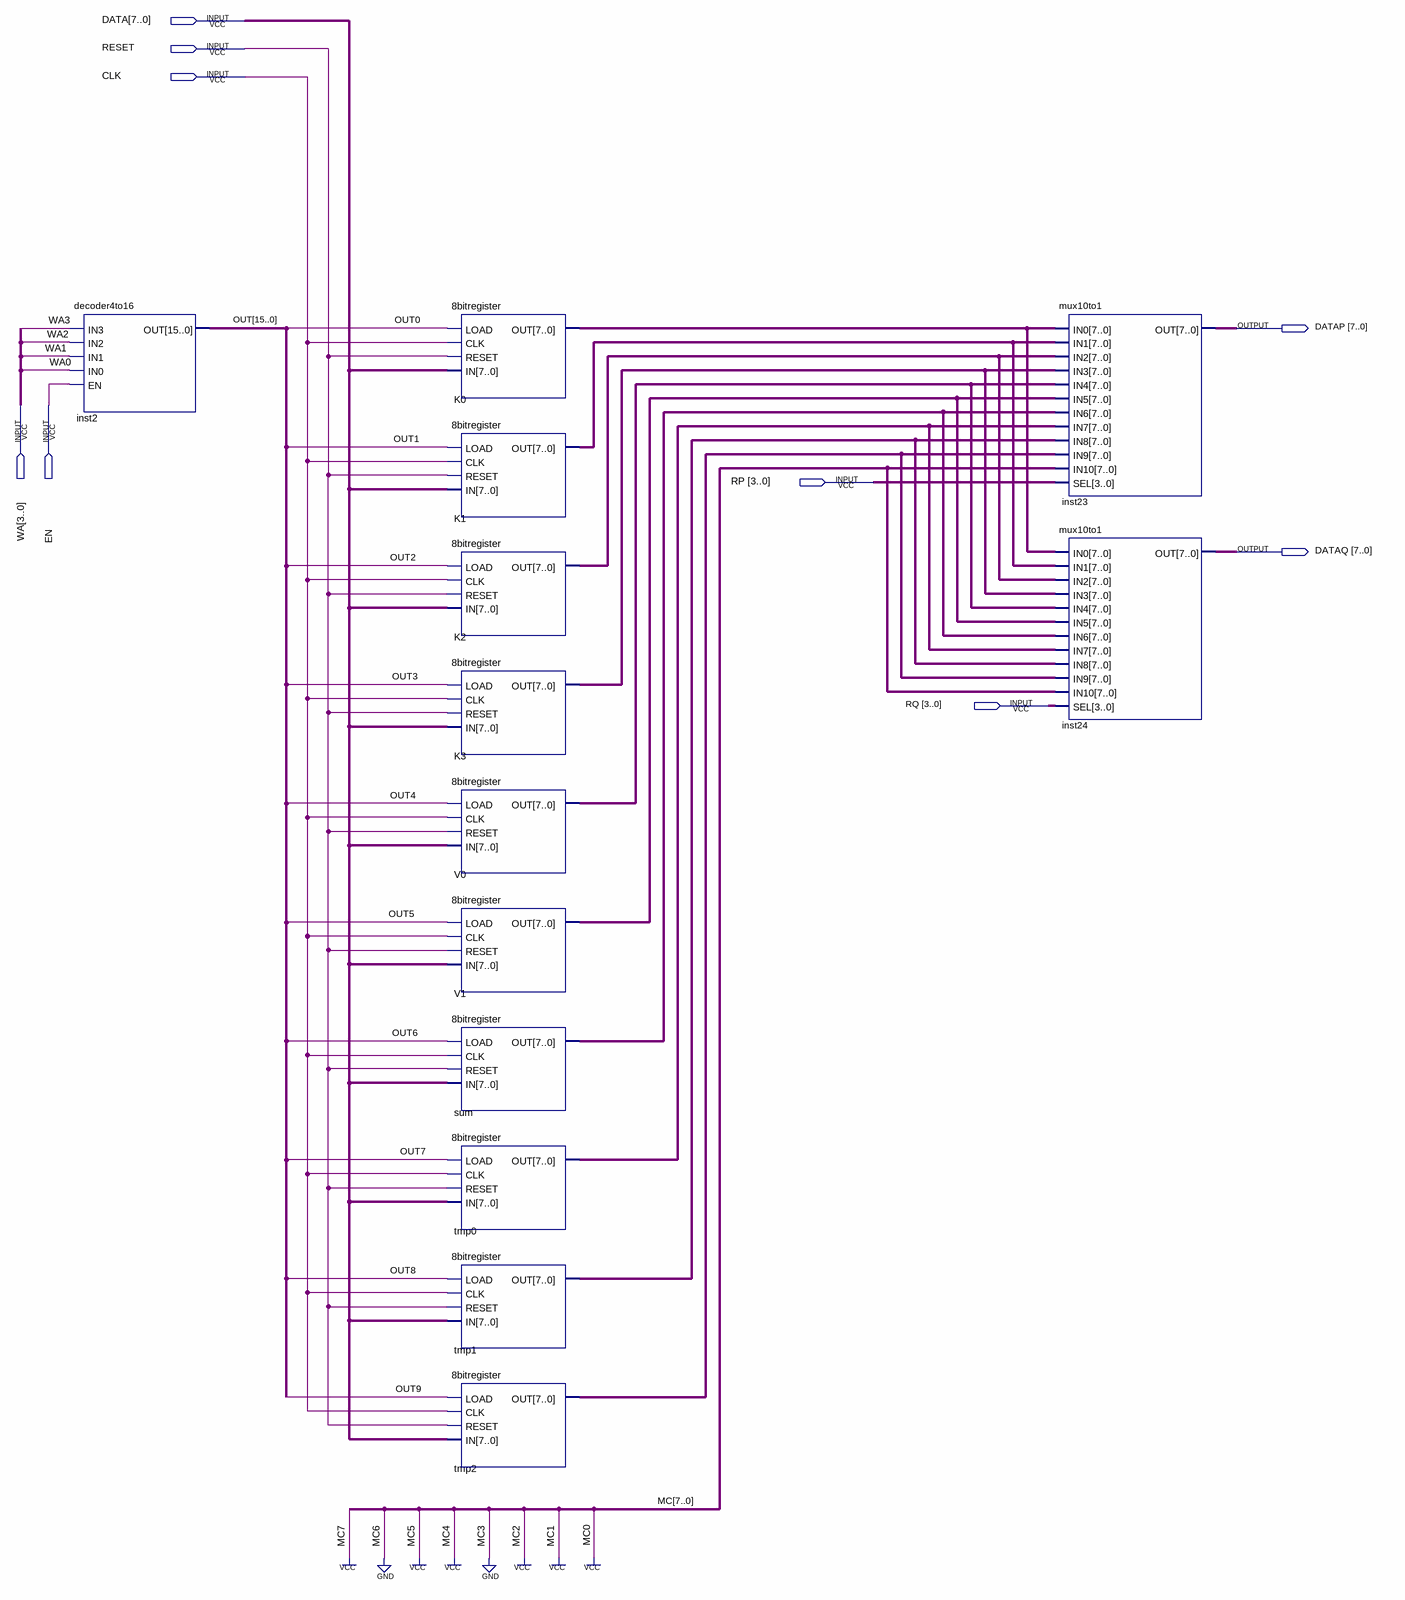
[diagram p0: schematic sheet]
// Quartus schematic reg10file8bit.bdf as structural Verilog: 13 symbols, 9 pins
module reg10file8bit (
  input  [7:0] DATA,
  input  RESET,
  input  CLK,
  input  [3:0] WA,
  input  EN,
  input  [3:0] RP,
  input  [3:0] RQ,
  output [7:0] DATAP,
  output [7:0] DATAQ
);

  wire [7:0] K0_out, K1_out, K2_out, K3_out, sum_out, tmp0_out, tmp1_out, tmp2_out, V0_out, V1_out;
  wire [15:0] OUT;

  decoder4to16 inst2 (.IN3(WA[3]), .IN2(WA[2]), .IN1(WA[1]), .IN0(WA[0]), .EN(EN), .OUT(OUT));
  \8bitregister  K0 (.LOAD(OUT[0]), .CLK(CLK), .RESET(RESET), .IN(DATA), .OUT(K0_out));
  \8bitregister  K1 (.LOAD(OUT[1]), .CLK(CLK), .RESET(RESET), .IN(DATA), .OUT(K1_out));
  \8bitregister  K2 (.LOAD(OUT[2]), .CLK(CLK), .RESET(RESET), .IN(DATA), .OUT(K2_out));
  \8bitregister  K3 (.LOAD(OUT[3]), .CLK(CLK), .RESET(RESET), .IN(DATA), .OUT(K3_out));
  \8bitregister  V0 (.LOAD(OUT[4]), .CLK(CLK), .RESET(RESET), .IN(DATA), .OUT(V0_out));
  \8bitregister  V1 (.LOAD(OUT[5]), .CLK(CLK), .RESET(RESET), .IN(DATA), .OUT(V1_out));
  \8bitregister  sum (.LOAD(OUT[6]), .CLK(CLK), .RESET(RESET), .IN(DATA), .OUT(sum_out));
  \8bitregister  tmp0 (.LOAD(OUT[7]), .CLK(CLK), .RESET(RESET), .IN(DATA), .OUT(tmp0_out));
  \8bitregister  tmp1 (.LOAD(OUT[8]), .CLK(CLK), .RESET(RESET), .IN(DATA), .OUT(tmp1_out));
  \8bitregister  tmp2 (.LOAD(OUT[9]), .CLK(CLK), .RESET(RESET), .IN(DATA), .OUT(tmp2_out));
  mux10to1 inst23 (
    .IN0(K0_out), .IN1(K1_out), .IN2(K2_out), .IN3(K3_out), .IN4(V0_out), .IN5(V1_out), .IN6(sum_out),
    .IN7(tmp0_out), .IN8(tmp1_out), .IN9(tmp2_out), .IN10(8'b10110111), .SEL(RP), .OUT(DATAP));
  mux10to1 inst24 (
    .IN0(K0_out), .IN1(K1_out), .IN2(K2_out), .IN3(K3_out), .IN4(V0_out), .IN5(V1_out), .IN6(sum_out),
    .IN7(tmp0_out), .IN8(tmp1_out), .IN9(tmp2_out), .IN10(8'b10110111), .SEL(RQ), .OUT(DATAQ));
endmodule
